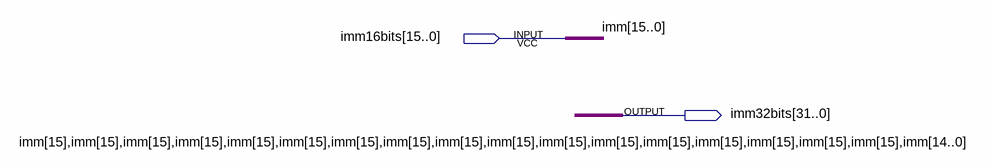
[diagram p0: schematic sheet]
// Quartus schematic SignalExtension.bdf as structural Verilog: 0 symbols, 2 pins
module SignalExtension (
  input  [15:0] imm16bits,
  output [31:0] imm32bits
);


  assign imm32bits = {{17{imm16bits[15]}}, imm16bits[14:0]};

  // Other names for the same wires on the sheet: imm[15:0] = imm16bits
endmodule
